# Altium schematic sheet Encoder - error.SchDoc
size A4
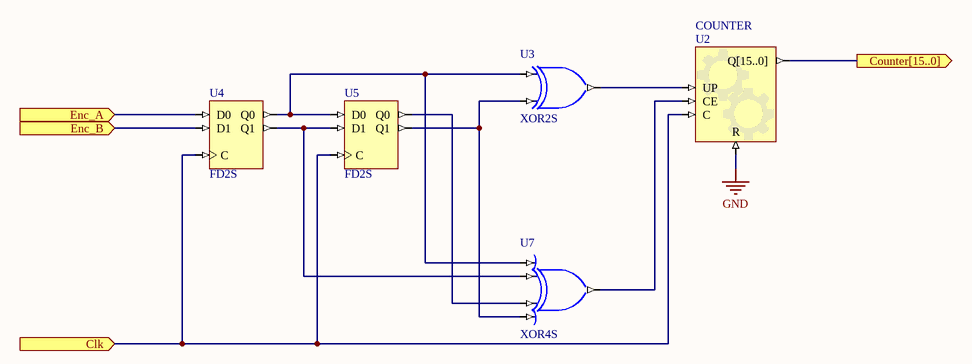
[diagram p0: Encoder - error.SchDoc]

## Parts
U2  COUNTER
U3  XOR2S
U4  FD2S
U5  FD2S
U7  XOR4S

## Ports
Clk (in), Counter[15..0] (out), Enc_A (in), Enc_B (in)

## Nets
GND: U2.R
Clk: U2.C U4.C U5.C ; port Clk
Counter[15..0]: U2.Q[15..0] ; port Counter[15..0]
Enc_A: U4.D0 ; port Enc_A
Enc_B: U4.D1 ; port Enc_B
NetU2_CE: U2.CE U7.O
NetU2_UP: U2.UP U3.O
NetU3_I0: U3.I0 U4.Q0 U5.D0 U7.I0
NetU3_I1: U3.I1 U5.Q1 U7.I3
NetU4_Q1: U4.Q1 U5.D1 U7.I1
NetU5_Q0: U5.Q0 U7.I2

## Library data of the parts
U2 = COUNTER: Configurable Counter; ConfiguratorName: GENERIC_COUNTER; ConfigurationParameters: {}Version[1.0]{}Type[Binary]{}SyncReset[True]{}NegativeClockEdge[False]{}FixedDirection[False]{}IsIncrement[False]{}SignalWidth[16]{}MaxValue[65535]{}BusOutput[True]{}Loadable[False]{}BusInput[False]{}; LastRevisionNo: 1.00.00; Published: 14-Jan-2009; Publisher: Altium Limited
U3 = XOR2: 2-Input Exclusive-OR Gate, Single Pin Version; XilinxEquivalent: XOR2; FunctionalClass: Logic Primitive; SubClass: XOR; PortSize: 2; ArchiveName: GENERIC; VHDLIB_SIM: GENERIC_LIB; Published: 29-Jan-2004; Publisher: Altium Limited; LastRevisionNo: 1.00.00; HelpURL: CR0118 FPGA Generic Library Guide.pdf#page=448; ComponentLink1URL: CR0136 FPGA Logic Primitive Resource Usage.pdf#page=301; ComponentLink1Description: Core &Resource Usage; PortStyle: Single Pin Version
U4 U5 = FD2S: 2-Bit D-Type Flip-Flop, Single Pin Version; SubClass: FD; ClockTrigger: Rising; PortSize: 2; ArchiveName: GENERIC; VHDLIB_SIM: GENERIC_LIB; Published: 29-Jan-2004; Publisher: Altium Limited; LastRevisionNo: 1.00.00; HelpURL: CR0118 FPGA Generic Library Guide.pdf#page=170; ComponentLink1URL: CR0133 FPGA Flip Flop Resource Usage.pdf#page=28; ComponentLink1Description: Core &Resource Usage; FunctionalClass: Flip-Flop; PortStyle: Single Pin Version
U7 = XOR4: 4-Input Exclusive-OR Gate, Single Pin Version; XilinxEquivalent: XOR4; FunctionalClass: Logic Primitive; SubClass: XOR; PortSize: 4; ArchiveName: GENERIC; VHDLIB_SIM: GENERIC_LIB; Published: 29-Jan-2004; Publisher: Altium Limited; LastRevisionNo: 1.00.00; HelpURL: CR0118 FPGA Generic Library Guide.pdf#page=448; ComponentLink1URL: CR0136 FPGA Logic Primitive Resource Usage.pdf#page=319; ComponentLink1Description: Core &Resource Usage; PortStyle: Single Pin Version